# EAGLE schematic AudioControllerSchematic_Photoresistor (EAGLE 9.6.2)
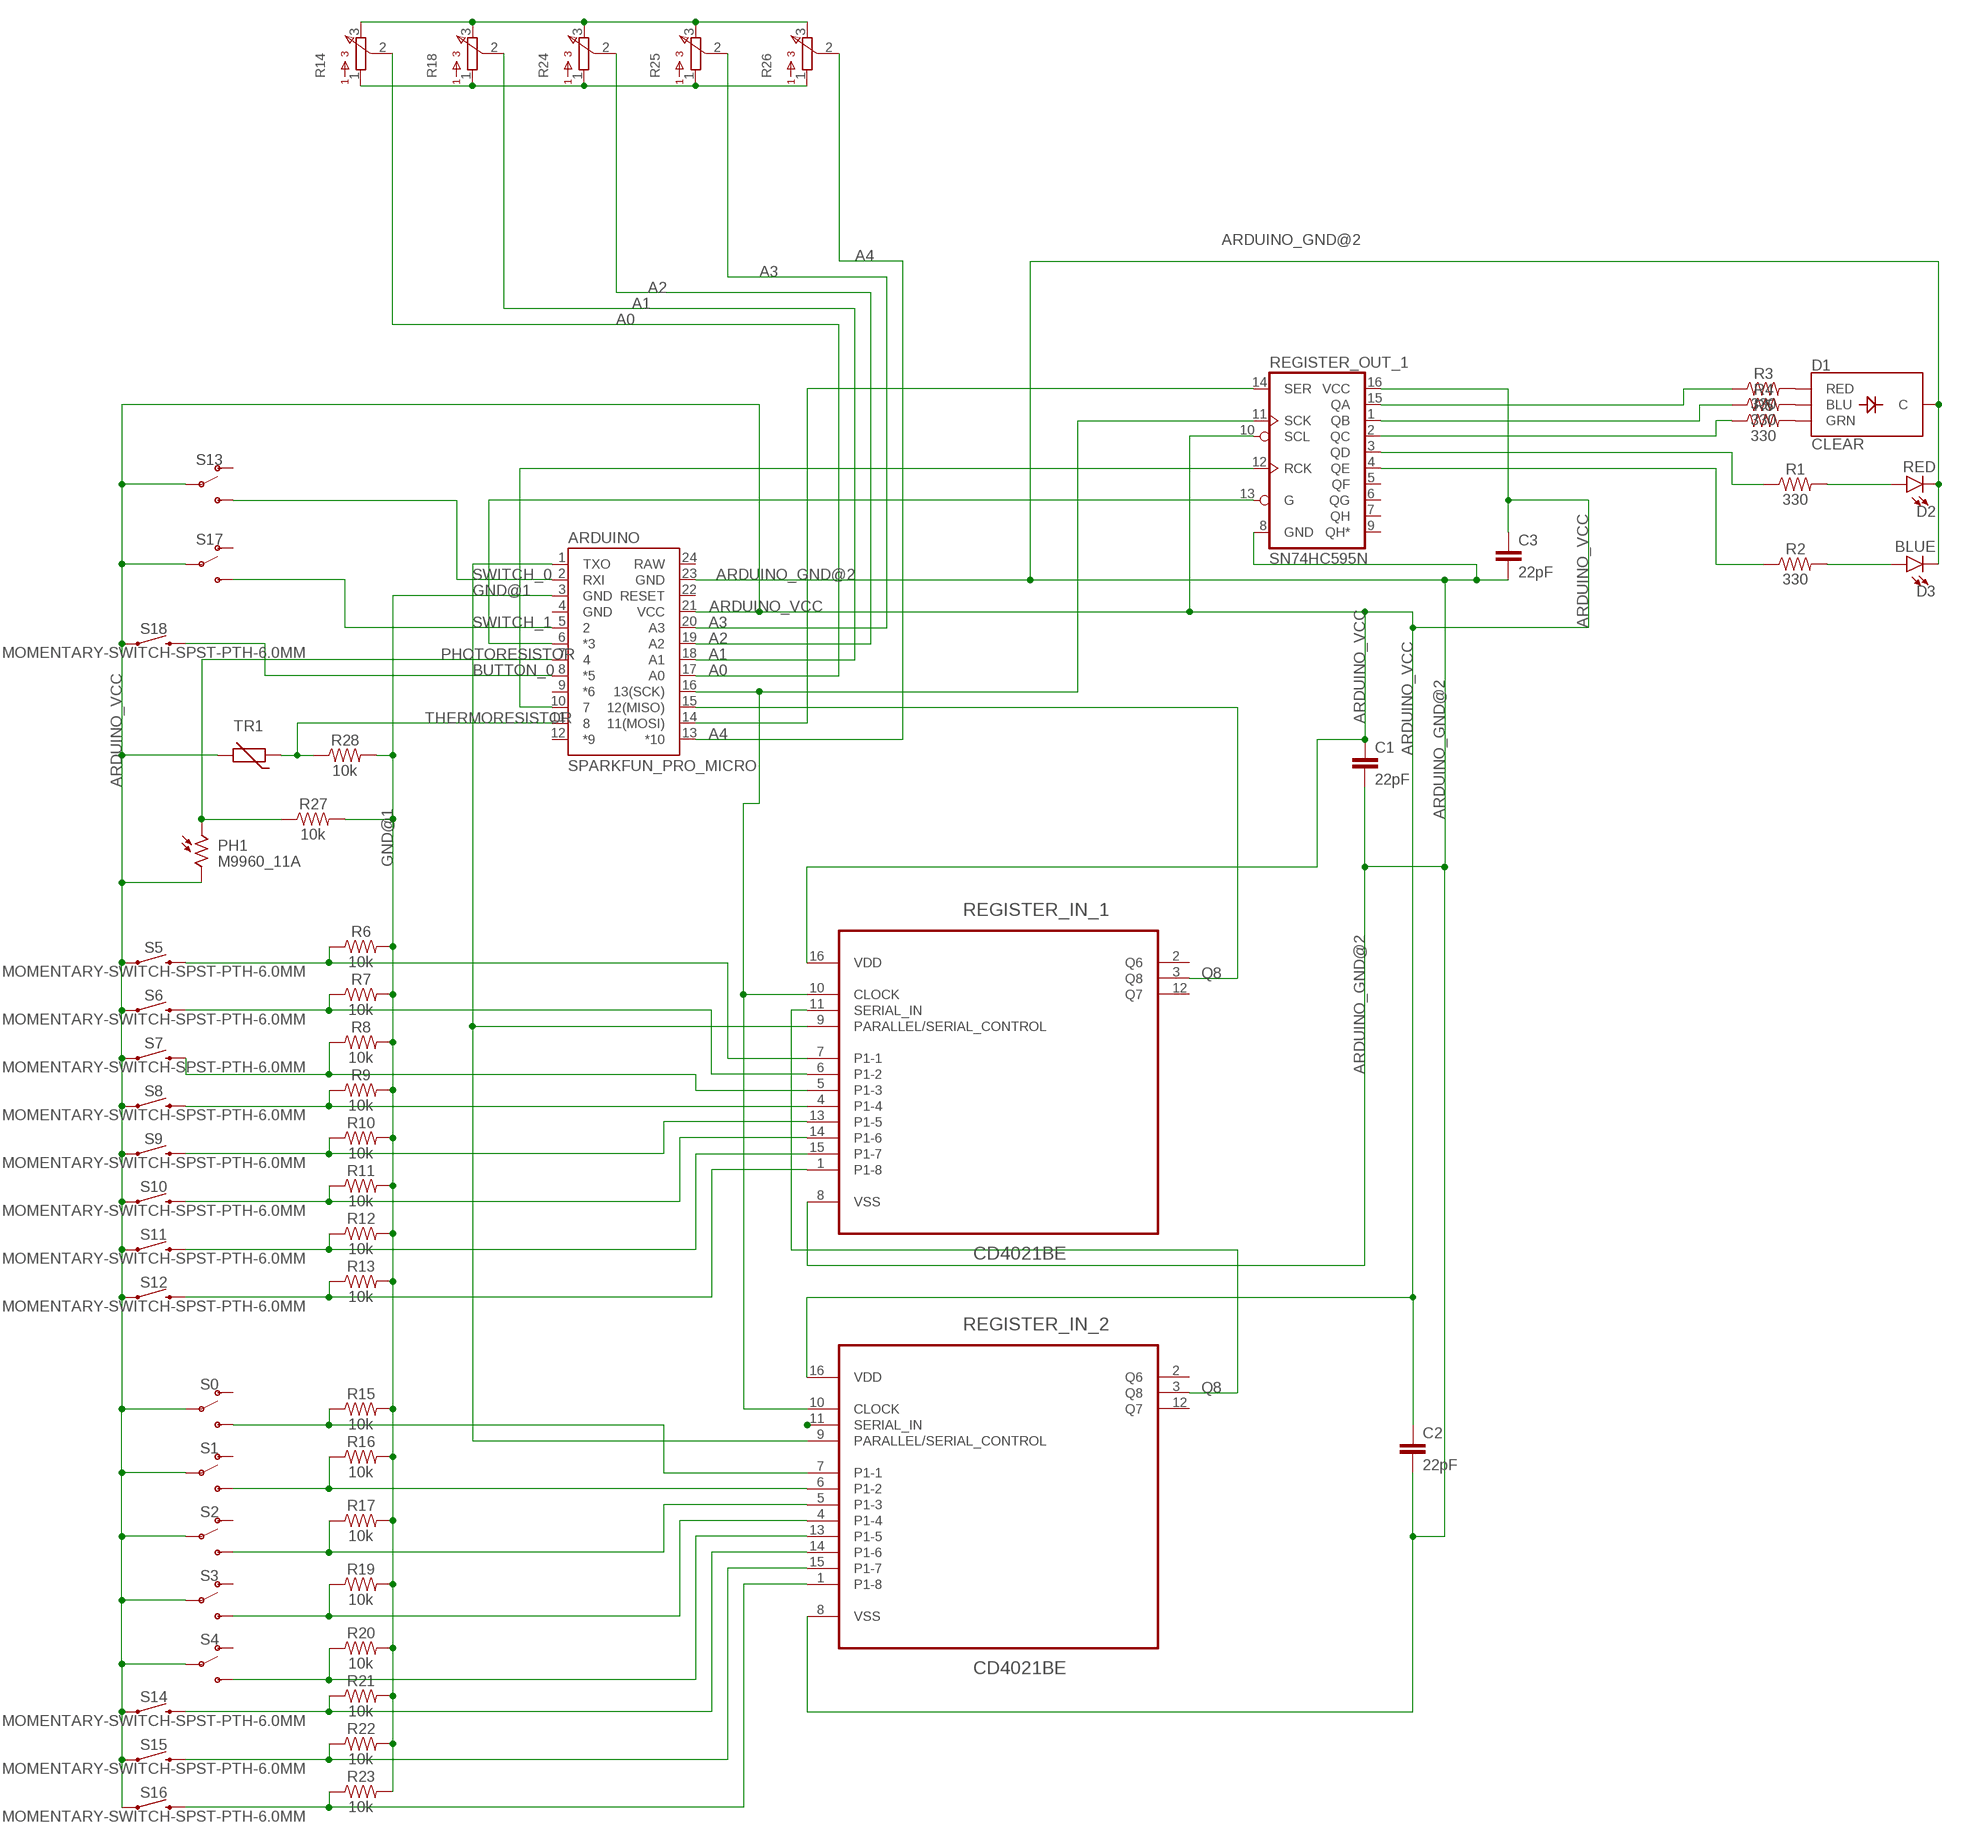
[diagram p0: schematic, sheet 1]

## Parts
ARDUINO  SPARKFUN_PRO_MICRO  [SPARKFUN_PRO_MICRO]
C1  22pF  22PF-0603-50V-5%  [0603]
C2  22pF  22PF-0603-50V-5%  [0603]
C3  22pF  22PF-0603-50V-5%  [0603]
D1  CLEAR  LED-RGB-CCCLEAR  [LED-RGB-THRU]
D2  RED  LED-RED0603  [LED-0603]
D3  BLUE  LED-BLUE0603  [LED-0603]
PH1  M9960_11A  [M9960]
R1  330  330OHM-0603-1/10W-1%  [0603]
R2  330  330OHM-0603-1/10W-1%  [0603]
R3  330  330OHM-0603-1/10W-1%  [0603]
R4  330  330OHM-0603-1/10W-1%  [0603]
R5  330  330OHM-0603-1/10W-1%  [0603]
R6  10k  10KOHM-0603-1/10W-1%  [0603]
R7  10k  10KOHM-0603-1/10W-1%  [0603]
R8  10k  10KOHM-0603-1/10W-1%  [0603]
R9  10k  10KOHM-0603-1/10W-1%  [0603]
R10  10k  10KOHM-0603-1/10W-1%  [0603]
R11  10k  10KOHM-0603-1/10W-1%  [0603]
R12  10k  10KOHM-0603-1/10W-1%  [0603]
R13  10k  10KOHM-0603-1/10W-1%  [0603]
R14  91  [91]
R15  10k  10KOHM-0603-1/10W-1%  [0603]
R16  10k  10KOHM-0603-1/10W-1%  [0603]
R17  10k  10KOHM-0603-1/10W-1%  [0603]
R18  91  [91]
R19  10k  10KOHM-0603-1/10W-1%  [0603]
R20  10k  10KOHM-0603-1/10W-1%  [0603]
R21  10k  10KOHM-0603-1/10W-1%  [0603]
R22  10k  10KOHM-0603-1/10W-1%  [0603]
R23  10k  10KOHM-0603-1/10W-1%  [0603]
R24  91  [91]
R25  91  [91]
R26  91  [91]
R27  10k  10KOHM-0603-1/10W-1%  [0603]
R28  10k  10KOHM-0603-1/10W-1%  [0603]
REGISTER_IN_1  CD4021BE  [DIP254P762X508-16]
REGISTER_IN_2  CD4021BE  [DIP254P762X508-16]
REGISTER_OUT_1  SN74HC595N  74HC595N  [DIP16]
S0  SWITCH-SPDT-PTH-11.6X4.0MM  [SWITCH_SPDT_PTH_11.6X4.0MM]
S1  SWITCH-SPDT-PTH-11.6X4.0MM  [SWITCH_SPDT_PTH_11.6X4.0MM]
S2  SWITCH-SPDT-PTH-11.6X4.0MM  [SWITCH_SPDT_PTH_11.6X4.0MM]
S3  SWITCH-SPDT-PTH-11.6X4.0MM  [SWITCH_SPDT_PTH_11.6X4.0MM]
S4  SWITCH-SPDT-PTH-11.6X4.0MM  [SWITCH_SPDT_PTH_11.6X4.0MM]
S5  MOMENTARY-SWITCH-SPST-PTH-6.0MM  [TACTILE_SWITCH_PTH_6.0MM]
S6  MOMENTARY-SWITCH-SPST-PTH-6.0MM  [TACTILE_SWITCH_PTH_6.0MM]
S7  MOMENTARY-SWITCH-SPST-PTH-6.0MM  [TACTILE_SWITCH_PTH_6.0MM]
S8  MOMENTARY-SWITCH-SPST-PTH-6.0MM  [TACTILE_SWITCH_PTH_6.0MM]
S9  MOMENTARY-SWITCH-SPST-PTH-6.0MM  [TACTILE_SWITCH_PTH_6.0MM]
S10  MOMENTARY-SWITCH-SPST-PTH-6.0MM  [TACTILE_SWITCH_PTH_6.0MM]
S11  MOMENTARY-SWITCH-SPST-PTH-6.0MM  [TACTILE_SWITCH_PTH_6.0MM]
S12  MOMENTARY-SWITCH-SPST-PTH-6.0MM  [TACTILE_SWITCH_PTH_6.0MM]
S13  SWITCH-SPDT-PTH-11.6X4.0MM  [SWITCH_SPDT_PTH_11.6X4.0MM]
S14  MOMENTARY-SWITCH-SPST-PTH-6.0MM  [TACTILE_SWITCH_PTH_6.0MM]
S15  MOMENTARY-SWITCH-SPST-PTH-6.0MM  [TACTILE_SWITCH_PTH_6.0MM]
S16  MOMENTARY-SWITCH-SPST-PTH-6.0MM  [TACTILE_SWITCH_PTH_6.0MM]
S17  SWITCH-SPDT-PTH-11.6X4.0MM  [SWITCH_SPDT_PTH_11.6X4.0MM]
S18  MOMENTARY-SWITCH-SPST-PTH-6.0MM  [TACTILE_SWITCH_PTH_6.0MM]
TR1  THERMISTOR_R-2,5  [RS-2,5]

## Nets
A0: ARDUINO.17(A0) R14.2
A1: ARDUINO.18(A1) R18.2
A2: ARDUINO.19(A2) R24.2
A3: ARDUINO.20(A3) R25.2
A4: ARDUINO.13(*10) R26.2
ARDUINO_GND@2: ARDUINO.23(GND) C1.2 C2.2 C3.2 D1.2(C) D2.C D3.C REGISTER_IN_1.8(VSS) REGISTER_IN_2.8(VSS) REGISTER_OUT_1.8(GND)
ARDUINO_VCC: ARDUINO.21(VCC) C1.1 C2.1 C3.1 PH1.2 REGISTER_IN_1.16(VDD) REGISTER_IN_2.16(VDD) REGISTER_OUT_1.10(SCL) REGISTER_OUT_1.16(VCC) S0.2(P) S1.2(P) S2.2(P) S3.2(P) S4.2(P) S5.1 S6.1 S7.1 S8.1 S9.1 S10.1 S11.1 S12.1 S13.2(P) S14.1 S15.1 S16.1 S17.2(P) S18.1 TR1.2
BUTTON_0: ARDUINO.8(*5) S18.3
GND@1: ARDUINO.3(GND) R6.2 R7.2 R8.2 R9.2 R10.2 R11.2 R12.2 R13.2 R15.2 R16.2 R17.2 R19.2 R20.2 R21.2 R22.2 R23.2 R27.2 R28.2
N$2: R6.1 REGISTER_IN_1.7(P1-1) S5.3
N$3: R14.3 R18.3 R24.3 R25.3 R26.3
N$4: ARDUINO.14(11(MOSI)) REGISTER_OUT_1.14(SER)
N$5: ARDUINO.1(TXO) REGISTER_IN_1.9(PARALLEL/SERIAL_CONTROL) REGISTER_IN_2.9(PARALLEL/SERIAL_CONTROL)
N$6: ARDUINO.10 REGISTER_OUT_1.12(RCK)
N$7: ARDUINO.6(*3) REGISTER_OUT_1.13(G)
N$8: R7.1 REGISTER_IN_1.6(P1-2) S6.3
N$9: R8.1 REGISTER_IN_1.5(P1-3) S7.3
N$10: R9.1 REGISTER_IN_1.4(P1-4) S8.3
N$11: R10.1 REGISTER_IN_1.13(P1-5) S9.3
N$12: R11.1 REGISTER_IN_1.14(P1-6) S10.3
N$13: R12.1 REGISTER_IN_1.15(P1-7) S11.3
N$14: R13.1 REGISTER_IN_1.1(P1-8) S12.3
N$15: R15.1 REGISTER_IN_2.7(P1-1) S0.3(S)
N$16: R16.1 REGISTER_IN_2.6(P1-2) S1.3(S)
N$18: R19.1 REGISTER_IN_2.4(P1-4) S3.3(S)
N$19: R20.1 REGISTER_IN_2.13(P1-5) S4.3(S)
N$20: R21.1 REGISTER_IN_2.14(P1-6) S14.3
N$21: R22.1 REGISTER_IN_2.15(P1-7) S15.3
N$22: R23.1 REGISTER_IN_2.1(P1-8) S16.3
N$23: R17.1 REGISTER_IN_2.5(P1-3) S2.3(S)
N$24: R5.1 REGISTER_OUT_1.2(QC)
N$25: R4.1 REGISTER_OUT_1.1(QB)
N$26: R3.1 REGISTER_OUT_1.15(QA)
N$27: R1.1 REGISTER_OUT_1.3(QD)
N$28: R2.1 REGISTER_OUT_1.4(QE)
N$29: D1.1(RED) R3.2
N$30: D1.4(BLU) R4.2
N$31: D1.3(GRN) R5.2
N$32: D2.A R1.2
N$33: D3.A R2.2
N$34: REGISTER_IN_2.11(SERIAL_IN)
N$35: ARDUINO.16(13(SCK)) REGISTER_IN_1.10(CLOCK) REGISTER_IN_2.10(CLOCK) REGISTER_OUT_1.11(SCK)
N$36: R14.1 R18.1 R24.1 R25.1 R26.1
PHOTORESISTOR: ARDUINO.7 PH1.1 R27.1
Q8: ARDUINO.15(12(MISO)) REGISTER_IN_1.3(Q8) REGISTER_IN_1.11(SERIAL_IN) REGISTER_IN_2.3(Q8)
SWITCH_0: ARDUINO.2(RXI) S13.3(S)
SWITCH_1: ARDUINO.5 S17.3(S)
THERMORESISTOR: ARDUINO.11 R28.1 TR1.1
Unconnected: ARDUINO.9(*6) ARDUINO.12(*9) ARDUINO.22(RESET) REGISTER_IN_1.2(Q6) REGISTER_IN_1.12(Q7) REGISTER_IN_2.2(Q6) REGISTER_IN_2.12(Q7) REGISTER_OUT_1.5(QF) REGISTER_OUT_1.6(QG) REGISTER_OUT_1.7(QH) REGISTER_OUT_1.9(QH*) S0.1(O) S1.1(O) S2.1(O) S3.1(O) S4.1(O) S13.1(O) S17.1(O)

## Power pins joined to a net without a drawn wire
GND: ARDUINO.4(GND)
RAW: ARDUINO.24(RAW)

## Library data of the parts
ARDUINO = SparkFun-Boards:SPARKFUN_PRO_MICRO: SparkFun Pro Micro Atmega32U4 compatible footprint. SparkFun Products: 3.3V/8MHz <https://www.sparkfun.com/products/12587> 5V/16MHz <https://www.sparkfun.com/products/12640>
C1-C3 = SparkFun-Capacitors:22PF: 22pF ceramic capacitors A capacitor is a passive two-terminal electrical component used to store electrical energy temporarily in an electric field.; PROD_ID: CAP-07876
D1 = SparkFun-LED:LED-RGB-CC: LED-RGB Common Cathode Packages: LED RGB-THRU LED_PIRANHA_5MM SparkFun Products: RGB Diffused Common Cathode- Diffuse <[https://www.sparkfun.com/products/9264]> RGB Diffused Common Cathode - Clear <[https://www.sparkfun.com/products/105]> LED-RGB 5mm Square (Piranha) <[https://www.sparkfun.com/products/11679]>; PROD_ID: DIO-08418
D2 = SparkFun-LED:LED-RED: Red SMD LED Used in manufacturing of most products at SparkFun Packages: 0603 - SMD 0603 package [Product Link] <http://docs.avagotech.com/docs/AV02-0551EN> 0603 SMART - SMD 0603 SMART package ( more efficient and expensive)[Product Link] <http://www.osram-os.com/Graphics/XPic2/00077099_0.pdf> 1206 - SMD1206 package [Product Link] <https://www.sparkfun.com/datasheets/DevTools/LilyPad/Q150OVS4.pdff> SparkFun Products: Pro Mini 328 -5V <https://www.sparkfun.com/products/821> RedBoard <https://www.sparkfun.com/products/12757> IOIO-OTG <https://www.sparkfun.com/products/13613>; PROD_ID: DIO-00819
D3 = SparkFun-LED:LED-BLUE: Blue SMD LED Used in manufacturing of various products at SparkFun Packages: 0603 - SMD 0603 package [Product Link] <http://www.digikey.com/product-detail/en/SMLE12BC7TT86/511-1589-2-ND/1641808> 1206 - SMD1206 package [Product Link] <http://www.digikey.com/product-detail/en/lite-on-inc/LTST-C150TBKT/160-1643-1-ND/573584> SparkFun Products: ESP8266 Thing-Dev Board <https://www.sparkfun.com/products/13711> RedBoard <https://www.sparkfun.com/products/12757>; PROD_ID: DIO-08575
PH1 = photo-elements:M9960_11: Photo Sensor Beacon Light, Photometer Applications Source: http://optoelectronics.perkinelmer.com/content/Datasheets/DTS_M9960.pdf
R1-R5 = SparkFun-Resistors:330OHM: 330Ω resistor A resistor is a passive two-terminal electrical component that implements electrical resistance as a circuit element. Resistors act to reduce current flow, and, at the same time, act to lower voltage levels within circuits. - Wikipedia; PROD_ID: RES-00818
R6-R13 R15-R17 R19-R23 R27 R28 = SparkFun-Resistors:10KOHM: 10kΩ resistor A resistor is a passive two-terminal electrical component that implements electrical resistance as a circuit element. Resistors act to reduce current flow, and, at the same time, act to lower voltage levels within circuits. - Wikipedia; PROD_ID: RES-00824
R14 R18 R24-R26 = bourns:91: 91 Series Potentiometer
REGISTER_IN_1 REGISTER_IN_2 = CD4021BE:CD4021BE: CMOS 8-STAGE SHIFT REGISTERS; AVAILABILITY: Unavailable; DESCRIPTION: CMOS 8-Stage Static Shift Register; MF: Texas; MP: CD4021BE; PACKAGE: DIP-16 Texas; PRICE: None; TEXAS_INSTRUMENTS-PURCHASE-URL: https://snapeda.com/shop?store=Texas+Instruments&id=1228561
REGISTER_OUT_1 = SparkFun-IC-Logic:74*595: 8-Bit Shift Register (Serial to Parallel) Datasheet <http://cdn.sparkfun.com/datasheets/BreakoutBoards/MM74HC595.pdf> SparkFun Products SparkFun Shift Register Breakout - 74HC595 <https://www.sparkfun.com/products/10680> (BOB-10680); PROD_ID: IC-13123
S0 S1-S4 S13 S17 = SparkFun-Switches:SWITCH-SPDT: Single Pole, Double Throw (SPDT) Switch Single-pole, double-throw (SPDT) switch. Variant Overview SMD-AYZ0202 Surface Mount DPDT Switch <https://www.sparkfun.com/products/597> (COM-00597) Used on e.g. LilyPad Arduino USB - ATmega32U4 Board <https://www.sparkfun.com/products/12049> PTH-11.6X4.0MM SPDT Mini Power Switch <https://www.sparkfun.com/products/102> (COM-00102) Used on e.g. SparkFun Simon Says - Through-Hole Soldering Kit <https://www.sparkfun.com/products/10547> (KIT-10547) PTH-11.6X4.0MM-KIT KIT version of SPDT Mini Power Switch - Simplifies soldering by removing tStop of switch pins - only one side can be soldered. PTH-11.6X4.0MM-LOCK LOCK version of SPDT Mini Power Switch - Offset pins hold switch in place for easier soldering. SMD-RIGHT-ANGLE Surface Mount Right Angle Switch <https://www.sparkfun.com/products/10860> (COM-10860) Used on e.g. SparkFun ESP8266 Thing <https://www.sparkfun.com/products/13231>; PROD_ID: SWCH-08261; SF_SKU: COM-00102
S5-S12 S14-S16 S18 = SparkFun-Switches:MOMENTARY-SWITCH-SPST: Momentary Switch (Pushbutton) - SPST Normally-open (NO) SPST momentary switches (buttons, pushbuttons). Variants PTH-12MM - 12mm square, through-hole Momentary Pushbutton Switch - 12mm Square <https://www.sparkfun.com/products/9190> (COM-09190) PTH-6.0MM, PTH-6.0MM-KIT - 6.0mm square, through-hole Mini Pushbutton Switch <https://www.sparkfun.com/products/97> (COM-00097) KIT package intended for soldering kit's - only one side of pads' copper is exposed. PTH-RIGHT-ANGLE-KIT - Right-angle, through-hole Right Angle Tactile Button <https://www.sparkfun.com/products/10791> - Used on SparkFun BigTime Watch Kit <https://www.sparkfun.com/products/11734> SMD-12MM - 12mm square, surface-mount Tactile Button - SMD (12mm) <https://www.sparkfun.com/products/12993> (COM-12993) Used on SparkFun PicoBoard <https://www.sparkfun.com/products/11888> SMD-4.5MM - 4.5mm Square Trackball Switch Used on SparkFun Blackberry Trackballer Breakout <https://www.sparkfun.com/products/13169> SMD-4.6MMX2.8MM - 4.60mm x 2.80mm, surface mount Used on SparkFun SAMD21 Mini Breakout <https://www.sparkfun.com/products/13664> SMD-5.2MM, SMD-5.2-REDUNDANT - 5.2mm square, surface-mount Mini Pushbutton Switch - SMD <https://www.sparkfun.com/products/8720> (COM-08720) Used on Arduino Pro Mini <https://www.sparkfun.com/products/11114> REDUNDANT package connects both switch circuits together SMD-6.0X3.5MM - 6.0 x 3.5mm, surface mount Momentary Reset Switch SMD <https://www.sparkfun.com/products/8229> (COM-08229) SMD-6.2MM-TALL - 6.2mm square, surface mount Tactile Button - SMD (6mm) <https://www.sparkfun.com/products/12992> Used on SparkFun Digital Sandbox <https://www.sparkfun.com/products/12651> SMD-RIGHT-ANGLE - Right-angle, surface mount Used on SparkFun Block for Intel® Edison - Arduino <https://www.sparkfun.com/products/13036>; PROD_ID: SWCH-08441; SF_SKU: COM-00097
TR1 = discrete:THERMISTOR_: Thermo Resistor